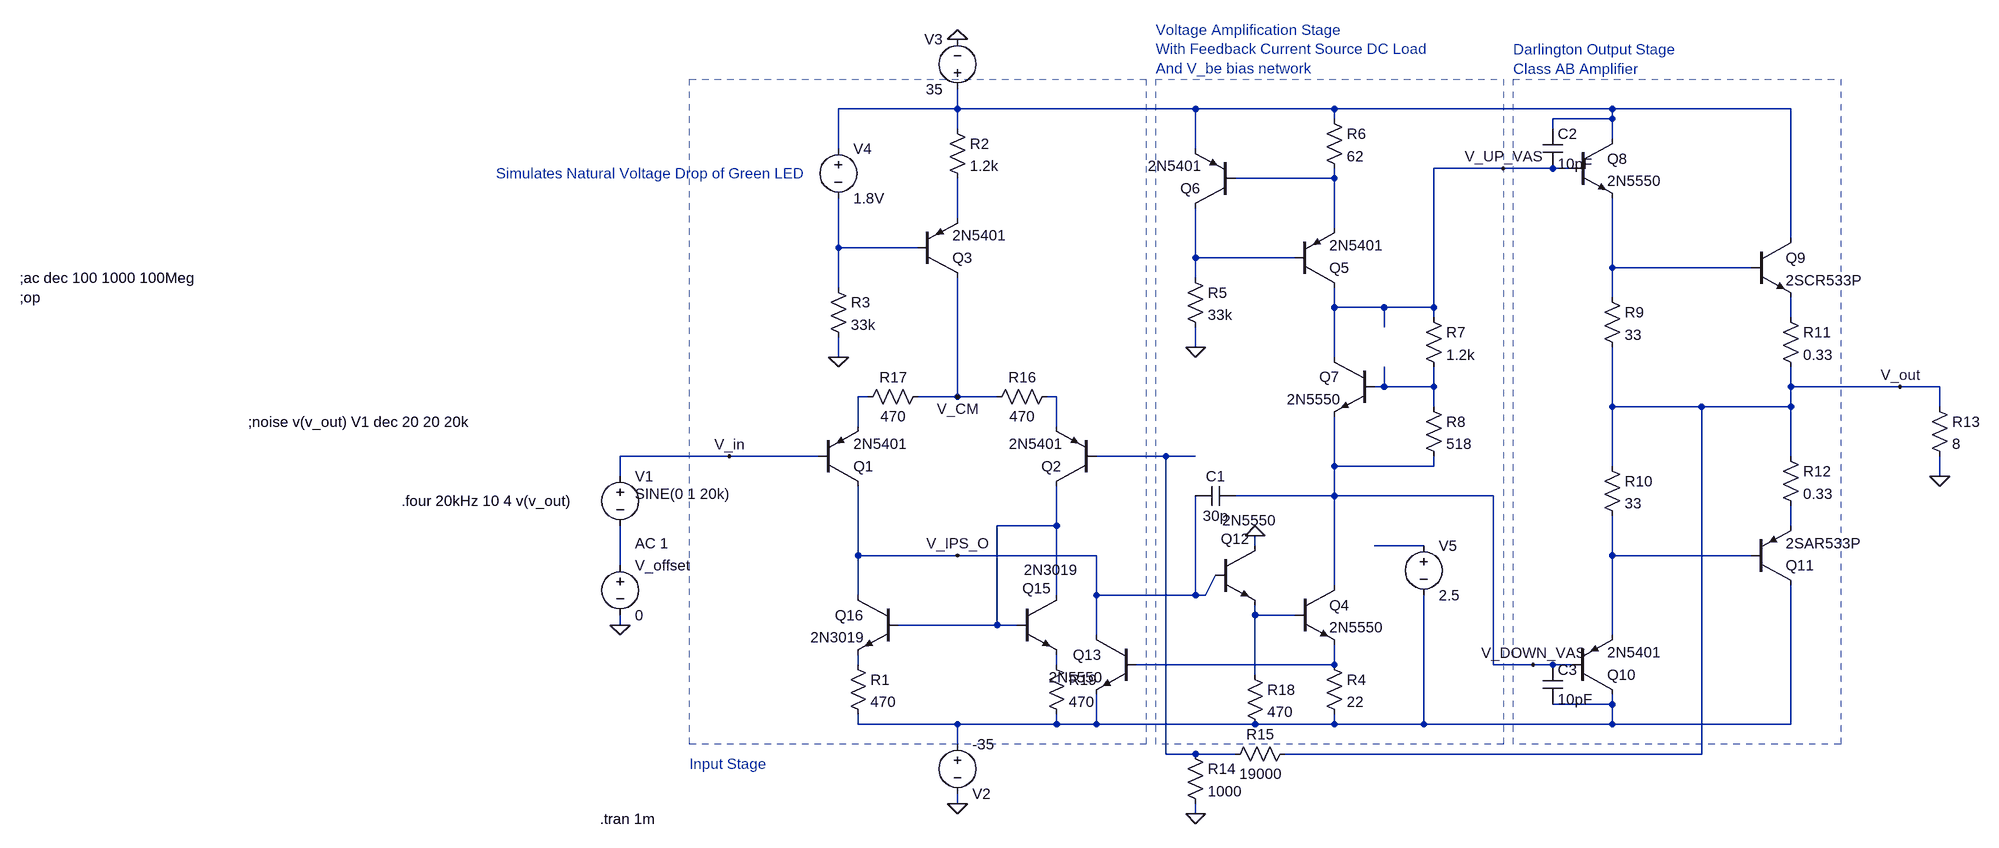
[diagram p0: schematic Add Current Mirror.asc]
Add Current Mirror.asc, the LTspice schematic file:
Version 4
SHEET 1 1848 888
WIRE 192 -416 192 -448
WIRE 192 -416 0 -416
WIRE 576 -416 192 -416
WIRE 800 -416 576 -416
WIRE 1248 -416 800 -416
WIRE 1536 -416 1248 -416
WIRE 800 -400 800 -416
WIRE 1248 -400 1248 -416
WIRE 1248 -400 1152 -400
WIRE 192 -384 192 -416
WIRE 1152 -384 1152 -400
WIRE 1248 -368 1248 -400
WIRE 0 -352 0 -416
WIRE 576 -352 576 -416
WIRE 1072 -320 960 -320
WIRE 1152 -320 1072 -320
WIRE 1184 -320 1152 -320
WIRE 800 -304 800 -320
WIRE 800 -304 640 -304
WIRE 192 -240 192 -304
WIRE 800 -224 800 -304
WIRE 1536 -208 1536 -416
WIRE 0 -192 0 -272
WIRE 128 -192 0 -192
WIRE 576 -176 576 -256
WIRE 736 -176 576 -176
WIRE 1248 -160 1248 -272
WIRE 1472 -160 1248 -160
WIRE 576 -144 576 -176
WIRE 0 -128 0 -192
WIRE 1248 -112 1248 -160
WIRE 800 -96 800 -128
WIRE 880 -96 800 -96
WIRE 960 -96 960 -320
WIRE 960 -96 880 -96
WIRE 960 -80 960 -96
WIRE 1536 -80 1536 -112
WIRE 880 -64 880 -96
WIRE 576 -32 576 -64
WIRE 0 -16 0 -48
WIRE 800 -16 800 -96
WIRE 880 32 880 0
WIRE 880 32 864 32
WIRE 960 32 960 0
WIRE 960 32 880 32
WIRE 1536 32 1536 0
WIRE 1712 32 1536 32
WIRE 1776 32 1712 32
WIRE 48 48 32 48
WIRE 192 48 192 -144
WIRE 192 48 128 48
WIRE 256 48 192 48
WIRE 352 48 336 48
WIRE 960 64 960 32
WIRE 1248 64 1248 -32
WIRE 1392 64 1248 64
WIRE 1536 64 1536 32
WIRE 1536 64 1392 64
WIRE 1776 64 1776 32
WIRE 32 96 32 48
WIRE 352 96 352 48
WIRE -176 144 -352 144
WIRE -32 144 -176 144
WIRE 528 144 416 144
WIRE 576 144 528 144
WIRE 1536 144 1536 64
WIRE 800 160 800 80
WIRE 960 160 960 144
WIRE 960 160 800 160
WIRE 1248 160 1248 64
WIRE -352 176 -352 144
WIRE 1776 176 1776 144
WIRE 800 208 800 160
WIRE 800 208 640 208
WIRE 1056 208 800 208
WIRE 352 256 352 192
WIRE 352 256 256 256
WIRE 1536 256 1536 224
WIRE 672 288 672 272
WIRE 944 288 864 288
WIRE 32 304 32 192
WIRE 192 304 32 304
WIRE 416 304 192 304
WIRE 1248 304 1248 240
WIRE 1472 304 1248 304
WIRE -352 320 -352 256
WIRE 800 352 800 208
WIRE 32 368 32 304
WIRE 352 368 352 256
WIRE 416 368 416 304
WIRE 576 368 576 208
WIRE 576 368 416 368
WIRE 592 368 608 336
WIRE 592 368 576 368
WIRE 672 400 672 384
WIRE 736 400 672 400
WIRE -352 416 -352 400
WIRE 256 416 256 256
WIRE 256 416 96 416
WIRE 288 416 256 416
WIRE 416 432 416 368
WIRE 1248 432 1248 304
WIRE 32 480 32 464
WIRE 352 480 352 464
WIRE 800 480 800 448
WIRE 800 480 480 480
WIRE 1056 480 1056 208
WIRE 1120 480 1056 480
WIRE 1152 480 1120 480
WIRE 1184 480 1152 480
WIRE 672 496 672 400
WIRE 1248 544 1248 528
WIRE 1248 544 1152 544
WIRE 32 576 32 560
WIRE 192 576 32 576
WIRE 352 576 352 560
WIRE 352 576 192 576
WIRE 416 576 416 528
WIRE 416 576 352 576
WIRE 672 576 416 576
WIRE 800 576 800 560
WIRE 800 576 672 576
WIRE 944 576 944 368
WIRE 944 576 800 576
WIRE 1248 576 1248 544
WIRE 1248 576 944 576
WIRE 1536 576 1536 352
WIRE 1536 576 1248 576
WIRE 192 608 192 576
WIRE 528 624 528 144
WIRE 576 624 528 624
WIRE 640 624 576 624
WIRE 1392 624 1392 64
WIRE 1392 624 720 624
WIRE 192 704 192 688
WIRE 576 720 576 704
FLAG -352 416 0
FLAG 192 704 0
FLAG 0 -16 0
FLAG 192 -528 0
FLAG 576 -32 0
FLAG 1776 176 0
FLAG 576 720 0
FLAG 1712 32 V_out
FLAG -176 144 V_in
FLAG 192 48 V_CM
FLAG 192 304 V_IPS_O
FLAG 1072 -320 V_UP_VAS
FLAG 1120 480 V_DOWN_VAS
FLAG 672 272 0
SYMBOL voltage 192 592 R0
WINDOW 0 24 96 Left 2
WINDOW 3 24 16 Left 2
WINDOW 123 0 0 Left 2
WINDOW 39 0 0 Left 2
SYMATTR InstName V2
SYMATTR Value -35
SYMBOL voltage 192 -432 R180
WINDOW 0 24 96 Left 2
WINDOW 3 24 16 Left 2
WINDOW 123 0 0 Left 2
WINDOW 39 0 0 Left 2
SYMATTR InstName V3
SYMATTR Value 35
SYMBOL res 176 -400 R0
SYMATTR InstName R2
SYMATTR Value 1.2k
SYMBOL res -16 -144 R0
SYMATTR InstName R3
SYMATTR Value 33k
SYMBOL pnp 128 -144 M180
SYMATTR InstName Q3
SYMATTR Value 2N5401
SYMBOL npn 736 352 R0
SYMATTR InstName Q4
SYMATTR Value 2N5550
SYMBOL res 784 464 R0
SYMATTR InstName R4
SYMATTR Value 22
SYMBOL cap 576 224 R270
WINDOW 0 32 32 VTop 2
WINDOW 3 0 32 VBottom 2
SYMATTR InstName C1
SYMATTR Value 30p
SYMBOL pnp 736 -128 M180
SYMATTR InstName Q5
SYMATTR Value 2N5401
SYMBOL pnp 640 -256 R180
SYMATTR InstName Q6
SYMATTR Value 2N5401
SYMBOL npn 864 -16 M0
SYMATTR InstName Q7
SYMATTR Value 2N5550
SYMBOL res 560 -160 R0
SYMATTR InstName R5
SYMATTR Value 33k
SYMBOL res 784 -416 R0
SYMATTR InstName R6
SYMATTR Value 62
SYMBOL res 944 -96 R0
SYMATTR InstName R7
SYMATTR Value 1.2k
SYMBOL res 944 48 R0
SYMATTR InstName R8
SYMATTR Value 518
SYMBOL res 1232 -128 R0
SYMATTR InstName R9
SYMATTR Value 33
SYMBOL res 1232 144 R0
SYMATTR InstName R10
SYMATTR Value 33
SYMBOL res 1520 -96 R0
SYMATTR InstName R11
SYMATTR Value 0.33
SYMBOL res 1520 128 R0
SYMATTR InstName R12
SYMATTR Value 0.33
SYMBOL res 1760 48 R0
SYMATTR InstName R13
SYMATTR Value 8
SYMBOL res 560 608 R0
SYMATTR InstName R14
SYMATTR Value 1000
SYMBOL res 736 608 R90
WINDOW 0 0 56 VBottom 2
WINDOW 3 32 56 VTop 2
SYMATTR InstName R15
SYMATTR Value 19000
SYMBOL pnp -32 192 M180
SYMATTR InstName Q1
SYMATTR Value 2N5401
SYMBOL pnp 416 192 R180
SYMATTR InstName Q2
SYMATTR Value 2N5401
SYMBOL npn 1184 -368 R0
SYMATTR InstName Q8
SYMATTR Value 2N5550
SYMBOL npn 1472 -208 R0
SYMATTR InstName Q9
SYMATTR Value 2SCR533P
SYMBOL pnp 1184 528 M180
SYMATTR InstName Q10
SYMATTR Value 2N5401
SYMBOL pnp 1472 352 M180
SYMATTR InstName Q11
SYMATTR Value 2SAR533P
SYMBOL voltage 0 -368 R0
WINDOW 123 0 0 Left 2
WINDOW 39 0 0 Left 2
SYMATTR InstName V4
SYMATTR Value 1.8V
SYMBOL voltage -352 304 R0
WINDOW 123 0 0 Left 2
WINDOW 39 0 0 Left 2
SYMATTR InstName V_offset
SYMATTR Value 0
SYMBOL voltage -352 160 R0
WINDOW 123 24 124 Left 2
WINDOW 39 0 0 Left 2
WINDOW 3 24 44 Left 2
SYMATTR Value2 AC 1
SYMATTR Value SINE(0 1 20k)
SYMATTR InstName V1
SYMBOL cap 1136 -384 R0
SYMATTR InstName C2
SYMATTR Value 10pF
SYMBOL cap 1136 480 R0
SYMATTR InstName C3
SYMATTR Value 10pF
SYMBOL res 352 32 R90
WINDOW 0 0 56 VBottom 2
WINDOW 3 32 56 VTop 2
SYMATTR InstName R16
SYMATTR Value 470
SYMBOL res 144 32 R90
WINDOW 0 0 56 VBottom 2
WINDOW 3 32 56 VTop 2
SYMATTR InstName R17
SYMATTR Value 470
SYMBOL npn 608 288 R0
WINDOW 0 9 -11 Left 2
WINDOW 3 11 -41 Left 2
SYMATTR InstName Q12
SYMATTR Value 2N5550
SYMBOL npn 480 432 M0
SYMATTR InstName Q13
SYMATTR Value 2N5550
SYMBOL res 656 480 R0
SYMATTR InstName R18
SYMATTR Value 470
SYMBOL voltage 944 272 R0
WINDOW 123 0 0 Left 2
WINDOW 39 0 0 Left 2
SYMATTR InstName V5
SYMATTR Value 2.5
SYMBOL npn 288 368 R0
WINDOW 0 9 -11 Left 2
WINDOW 3 11 -41 Left 2
SYMATTR InstName Q15
SYMATTR Value 2N3019
SYMBOL npn 96 368 M0
SYMATTR InstName Q16
SYMATTR Value 2N3019
SYMBOL res 16 464 R0
SYMATTR InstName R1
SYMATTR Value 470
SYMBOL res 336 464 R0
SYMATTR InstName R19
SYMATTR Value 470
TEXT -384 728 Left 2 !.tran 1m
TEXT -240 640 Left 2 ;Input Stage
TEXT -552 -312 Left 2 ;Simulates Natural Voltage Drop of Green LED
TEXT -1320 -144 Left 2 !;ac dec 100 1000 100Meg
TEXT -1320 -112 Left 2 !;op
TEXT 512 -544 Left 2 ;Voltage Amplification Stage\nWith Feedback Current Source DC Load\nAnd V_be bias network
TEXT 1088 -512 Left 2 ;Darlington Output Stage\nClass AB Amplifier
TEXT -952 88 Left 2 !;noise v(v_out) V1 dec 20 20 20k
TEXT -704 216 Left 2 !.four 20kHz 10 4 v(v_out)
RECTANGLE Normal 496 608 -240 -464 2
RECTANGLE Normal 1072 608 512 -464 2
RECTANGLE Normal 1616 608 1088 -464 2

The netlist it stands for:
* Add Current Mirror.asc
V2 N021 0 -35
V3 N001 0 35
R2 N001 N003 1.2k
R3 N004 0 33k
Q3 V_CM N004 N003 0 2N5401
Q4 V_DOWN_VAS N017 N020 0 2N5550
R4 N020 N021 22
C1 V_IPS_O V_DOWN_VAS 30p
Q5 V_UP_VAS N005 N002 0 2N5401
Q6 N005 N002 N001 0 2N5401
Q7 V_UP_VAS N008 V_DOWN_VAS 0 2N5550
R5 N005 0 33k
R6 N001 N002 62
R7 V_UP_VAS N008 1.2k
R8 N008 V_DOWN_VAS 518
R9 N006 V_out 33
R10 V_out N015 33
R11 N007 V_out 0.33
R12 V_out N013 0.33
R13 V_out 0 8
R14 N011 0 1000
R15 V_out N011 19000
Q1 V_IPS_O V_in N009 0 2N5401
Q2 N012 N011 N010 0 2N5401
Q8 N001 V_UP_VAS N006 0 2N5550
Q9 N001 N006 N007 0 2SCR533P
Q10 N021 V_DOWN_VAS N015 0 2N5401
Q11 N021 N015 N013 0 2SAR533P
V4 N001 N004 1.8V
V_offset N016 0 0
V1 V_in N016 SINE(0 1 20k) AC 1
C2 N001 V_UP_VAS 10pF
C3 V_DOWN_VAS N021 10pF
R16 N010 V_CM 470
R17 V_CM N009 470
Q12 0 V_IPS_O N017 0 2N5550
Q13 V_IPS_O N020 N021 0 2N5550
R18 N017 N021 470
V5 N014 N021 2.5
Q15 N012 N012 N019 0 2N3019
Q16 V_IPS_O N012 N018 0 2N3019
R1 N018 N021 470
R19 N019 N021 470
.model NPN NPN
.model PNP PNP
.lib standard.bjt
.tran 1m
* Input Stage
* Simulates Natural Voltage Drop of Green LED
;ac dec 100 1000 100Meg
;op
* Voltage Amplification Stage
* With Feedback Current Source DC Load
* And V_be bias network
* Darlington Output Stage
* Class AB Amplifier
;noise v(v_out) V1 dec 20 20 20k
.four 20kHz 10 4 v(v_out)
.backanno
.end